# Altium schematic sheet LoadCell_Amp_SCH.SchDoc
size A
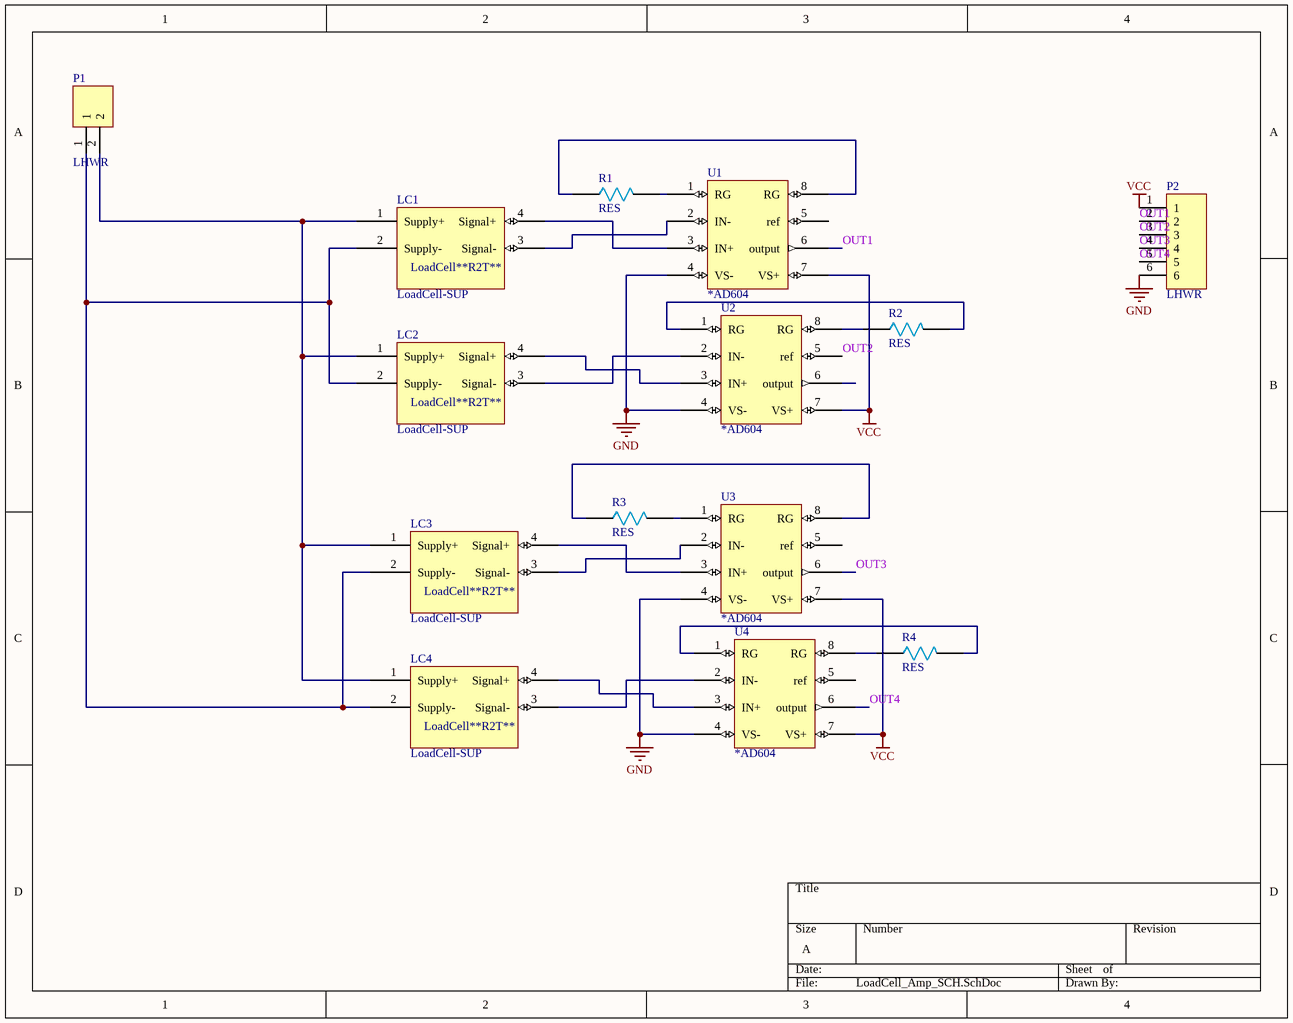
[diagram p0: LoadCell_Amp_SCH.SchDoc]

## Parts
LC1  LoadCell-SUP  [LoadCell-SUP]
LC2  LoadCell-SUP  [LoadCell-SUP]
LC3  LoadCell-SUP  [LoadCell-SUP]
LC4  LoadCell-SUP  [LoadCell-SUP]
P1  LHWR  [Polarized Header 2]
P2  LHWR  [Polarized Header 6]
R1  RES  [AXIAL0.4]
R2  RES  [AXIAL0.4]
R3  RES  [AXIAL0.4]
R4  RES  [AXIAL0.4]
U1  *AD604  [AD620-Soic]
U2  *AD604  [AD620-Soic]
U3  *AD604  [AD620-Soic]
U4  *AD604  [AD620-Soic]

## Nets
GND: P2.6 U1.4(VS-) U2.4(VS-) U3.4(VS-) U4.4(VS-)
VCC: P2.1 U1.7(VS+) U2.7(VS+) U3.7(VS+) U4.7(VS+)
OUT1: P2.2 U1.6(output)
OUT2: P2.3 U2.5(ref)
OUT3: P2.4 U3.6(output)
OUT4: P2.5 U4.6(output)
NetLC1_1: LC1.1(Supply+) LC2.1(Supply+) LC3.1(Supply+) LC4.1(Supply+) P1.2
NetLC1_2: LC1.2(Supply-) LC2.2(Supply-) LC3.2(Supply-) LC4.2(Supply-) P1.1
NetLC1_3: LC1.3(Signal-) U1.2(IN-)
NetLC1_4: LC1.4(Signal+) U1.3(IN+)
NetLC2_3: LC2.3(Signal-) U2.2(IN-)
NetLC2_4: LC2.4(Signal+) U2.3(IN+)
NetLC3_3: LC3.3(Signal-) U3.2(IN-)
NetLC3_4: LC3.4(Signal+) U3.3(IN+)
NetLC4_3: LC4.3(Signal-) U4.2(IN-)
NetLC4_4: LC4.4(Signal+) U4.3(IN+)
NetR1_1: R1.1 U1.8(RG)
NetR1_2: R1.2 U1.1(RG)
NetR2_1: R2.1 U2.8(RG)
NetR2_2: R2.2 U2.1(RG)
NetR3_1: R3.1 U3.8(RG)
NetR3_2: R3.2 U3.1(RG)
NetR4_1: R4.1 U4.8(RG)
NetR4_2: R4.2 U4.1(RG)

Not connected (* = marked no-connect by the designer): U1 5(ref); U2 6(output); U3 5(ref); U4 5(ref)

## Notes on the sheet
- (in symbol LoadCell-SUP) LoadCell**R2T**

## Library data of the parts
P1 = 2pin LHWR: Designer:: Hamed Jafarzadeh - www.R2T.ir
P2 = 6pin LHWR: Designer:: Hamed Jafarzadeh - www.R2T.ir
U1-U4 = AD620: Instrumental Amplifire